# EAGLE design Modular Recon Drone (EAGLE 9.0.1)
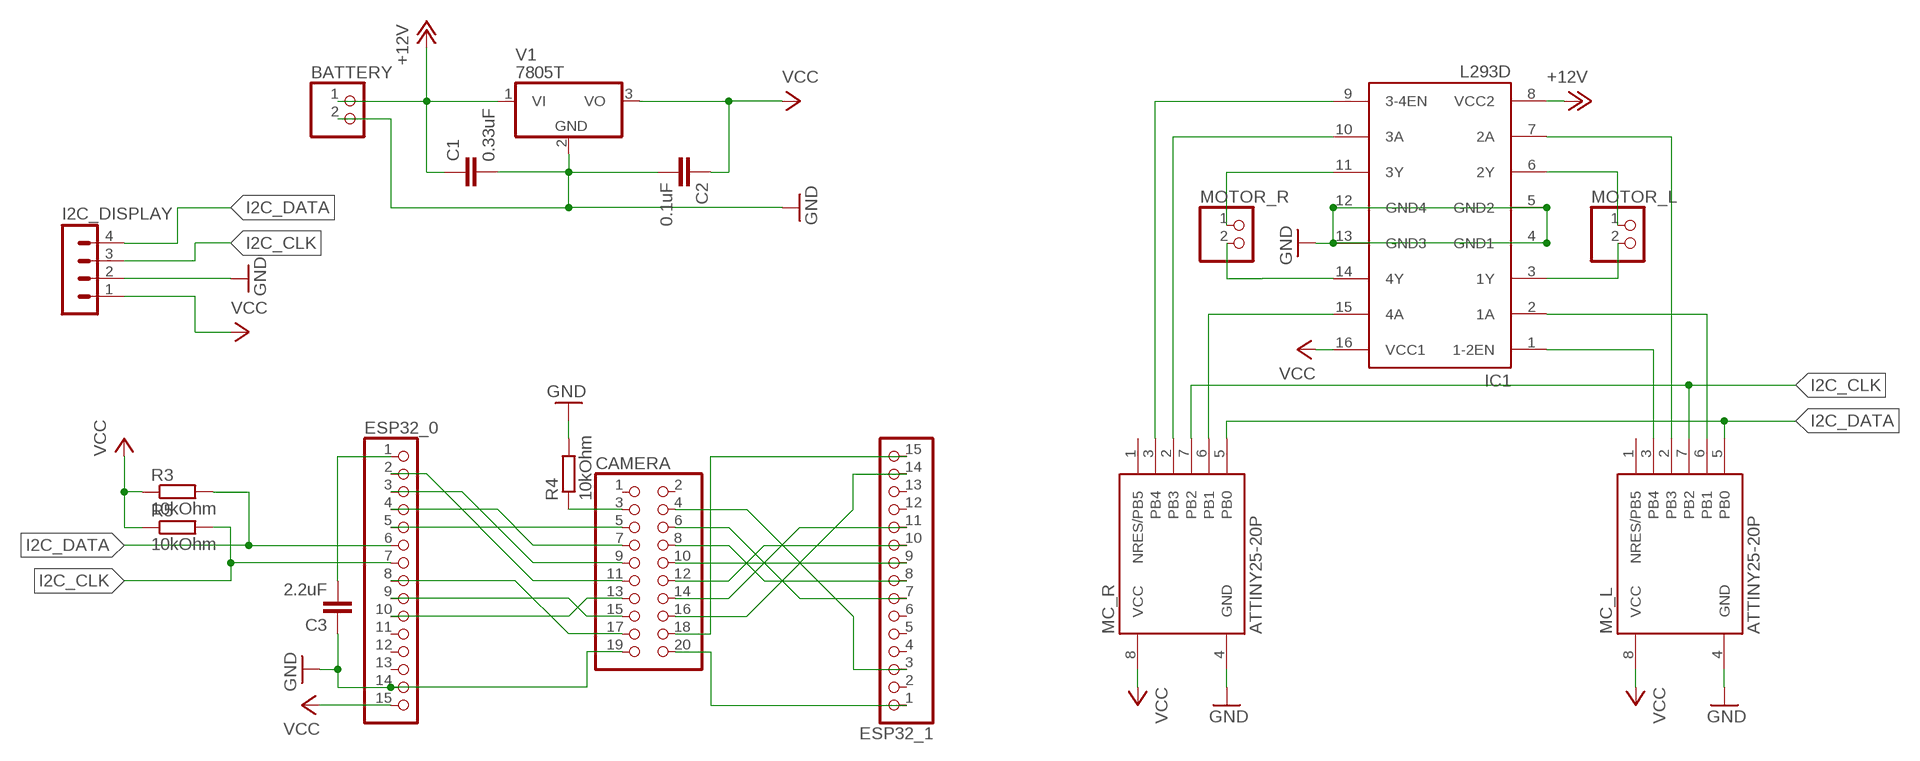
[diagram p0: schematic, sheet 1]

## Parts
BATTERY  PINHD-1X2  [1X02]
C1  0.33uF  C-EU025-050X050  [C025-050X050]
C2  0.1uF  C-EU025-050X050  [C025-050X050]
C3  2.2uF  C-EU025-050X050  [C025-050X050]
CAMERA  PINHD-2X10  [2X10]
ESP32_0  PINHD-1X15  [1X15]
ESP32_1  PINHD-1X15  [1X15]
I2C_DISPLAY  MA04-1  [MA04-1]
IC1  L293D  [DIL16]
MC_L  ATTINY25-20P  [PDIP08_300MIL]
MC_R  ATTINY25-20P  [PDIP08_300MIL]
MOTOR_L  PINHD-1X2  [1X02]
MOTOR_R  PINHD-1X2  [1X02]
R3  10kOhm  R-EU_0204/5  [0204/5]
R4  10kOhm  R-EU_0204/5  [0204/5]
R5  10kOhm  R-EU_0204/5  [0204/5]
V1  7805T  [TO220H]

## Nets
+12V [power]: BATTERY.1 C1.1 IC1.8(VCC2) V1.1(VI)
GND: BATTERY.2 C1.2 C2.2 C3.1 CAMERA.19 ESP32_0.14 I2C_DISPLAY.2 IC1.4(GND1) IC1.5(GND2) IC1.12(GND4) IC1.13(GND3) MC_L.4(GND) MC_R.4(GND) R4.2 V1.2(GND)
I2C_CLK: ESP32_0.7 I2C_DISPLAY.3 MC_L.7(PB2) MC_R.7(PB2) R5.2
I2C_DATA: ESP32_0.6 I2C_DISPLAY.4 MC_L.5(PB0) MC_R.5(PB0) R3.2
N$1: IC1.3(1Y) MOTOR_L.2
N$2: IC1.6(2Y) MOTOR_L.1
N$4: IC1.14(4Y) MOTOR_R.2
N$5: IC1.15(4A) MC_R.6(PB1)
N$6: IC1.11(3Y) MOTOR_R.1
N$7: IC1.2(1A) MC_L.6(PB1)
N$8: IC1.10(3A) MC_R.2(PB3)
N$9: IC1.7(2A) MC_L.2(PB3)
N$10: IC1.9(3-4EN) MC_R.3(PB4)
N$11: IC1.1(1-2EN) MC_L.3(PB4)
N$12: CAMERA.20 ESP32_1.1
N$13: CAMERA.18 ESP32_1.15
N$14: CAMERA.16 ESP32_1.14
N$15: CAMERA.14 ESP32_1.11
N$16: CAMERA.12 ESP32_1.10
N$17: CAMERA.10 ESP32_1.9
N$18: CAMERA.8 ESP32_1.8
N$19: CAMERA.6 ESP32_1.7
N$20: CAMERA.4 ESP32_1.3
N$21: CAMERA.17 ESP32_0.8
N$22: CAMERA.15 ESP32_0.9
N$23: CAMERA.13 ESP32_0.10
N$24: CAMERA.11 ESP32_0.2
N$25: CAMERA.9 ESP32_0.3
N$26: CAMERA.7 ESP32_0.4
N$27: CAMERA.5 ESP32_0.5
N$28: CAMERA.3 R4.1
N$29: C3.2 ESP32_0.1
VCC: C2.1 ESP32_0.15 I2C_DISPLAY.1 IC1.16(VCC1) MC_L.8(VCC) MC_R.8(VCC) R3.1 R5.1 V1.3(VO)
Unconnected: CAMERA.1 CAMERA.2 ESP32_0.11 ESP32_0.12 ESP32_0.13 ESP32_1.2 ESP32_1.4 ESP32_1.5 ESP32_1.6 ESP32_1.12 ESP32_1.13 MC_L.1(NRES/PB5) MC_R.1(NRES/PB5)

## Library data of the parts
BATTERY MOTOR_L MOTOR_R = pinhead:PINHD-1X2: PIN HEADER
C1-C3 = rcl:C-EU: CAPACITOR, European symbol; SPICEPREFIX: C
CAMERA = pinhead:PINHD-2X10: PIN HEADER
ESP32_0 ESP32_1 = pinhead:PINHD-1X15: PIN HEADER
I2C_DISPLAY = con-lstb:MA04-1: PIN HEADER; OC_FARNELL: unknown; OC_NEWARK: unknown
IC1 = st-microelectronics:L293D: PUSH-PULL 4 CHANNEL DRIVER; MPN: L293D; OC_FARNELL: 9589619; OC_NEWARK: 56P8249
MC_L MC_R = _hhn_attiny25_45_85:ATTINY25*: ATMEL ATtiny 25 Packages: P = PDIP 08 30mil S = SOIC 08 EIAJ 208mil SS = SOIC 08 JEDEC 150mil Technologies Note: for complete ordering code (temp. range, finish, tape&reel etc.) see www.atmel.com • Supply Voltage: V = (1.8…5.5)V | [blank] = (2.7…5.5)V • Speed: 10 = 10 MHz | 20 = 20 MHz Author: Dipl.-Ing. FH Rainer Bayer HHN Hochschule Heilbronn (Heilbronn University), rainer.bayer@hs-heilbronn.de Ingenieurbüro ing-rb, mail@ing-rb.de
R3-R5 = rcl:R-EU_: RESISTOR, European symbol; SPICEPREFIX: R
V1 = linear:78*: Positive VOLTAGE REGULATOR Source: http://cache.national.com/ds/LM/LM78L05.pdf http://www.fairchildsemi.com/ds/LM/LM7805.pdf

## Net classes
1 power: width 1.27 mm, clearance 0.254 mm

## Board
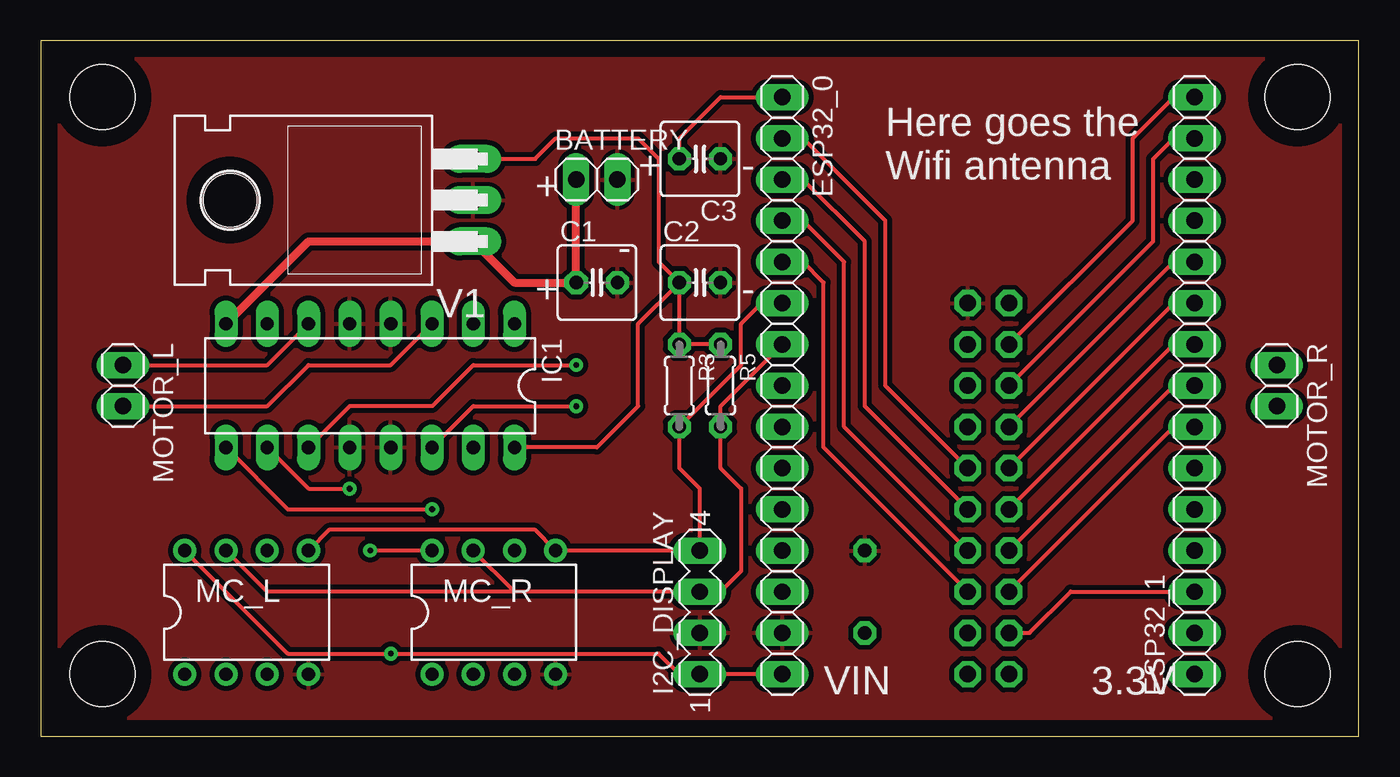
[diagram p1: board, top side]
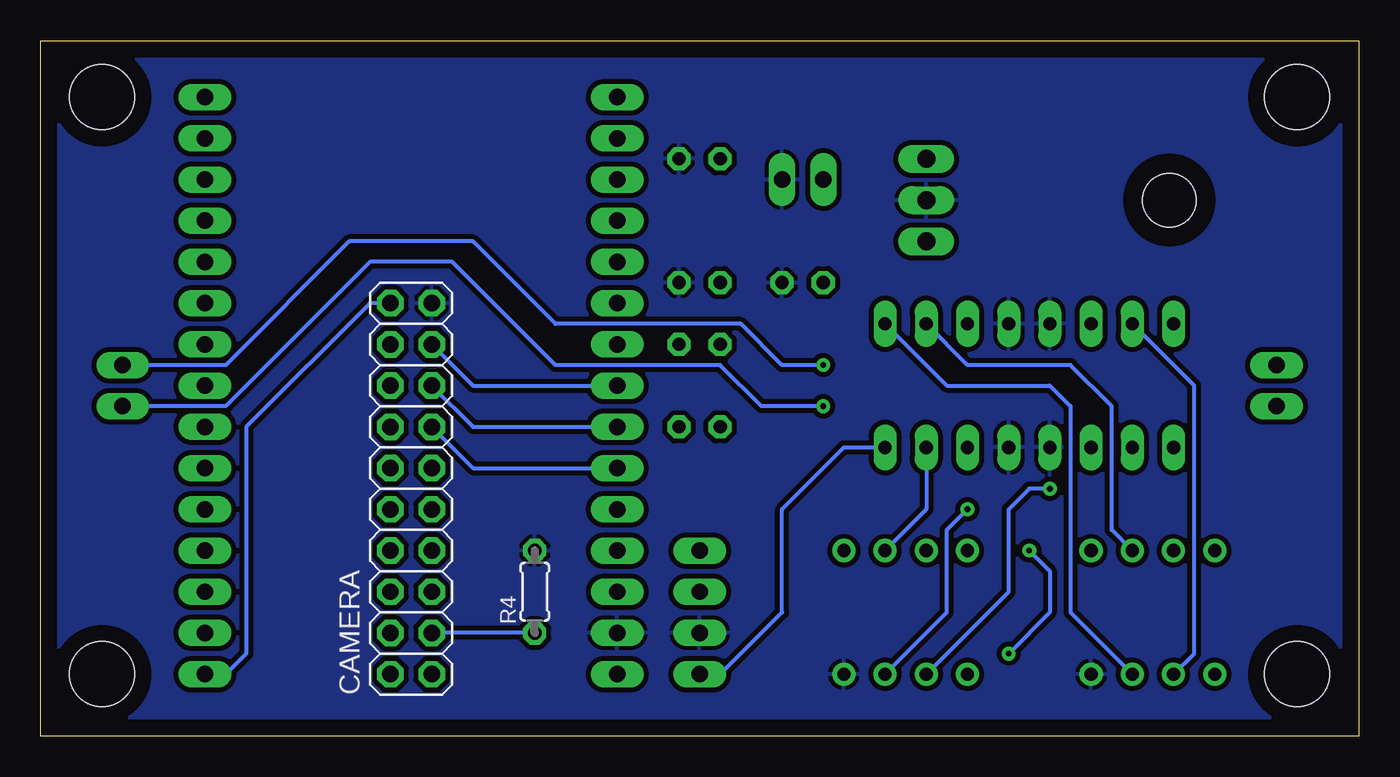
[diagram p2: board, bottom side, seen from below]

Size 81.26 x 42.85 mm. Coordinates in mm from the lower left corner, seen from the top.
Outline: 0,0 81.26,0 81.26,42.85 0,42.85 0,0
Copper layers (1*16): Top 0.035mm / dielectric 1.5mm / Bottom 0.035mm
Design rules "default *": minimum track width 10mil, minimum drill 0.35mm, track to track 8mil, track to pad 8mil, pad to pad 8mil, via to via 8mil, smd to smd 8mil, copper to edge 40mil, drill to drill 6mil, minimum pad ring 12mil, minimum via ring 10mil, stop-mask expansion 4mil, vias tented up to drill 0mil, thermal gap 10mil
Holes 4 mm at 3.81,39.37 3.81,3.81 77.47,3.81 77.47,39.37

### Footprints (pad centres in the part's own frame; a part is rotated, then mirrored left to right if it is on the bottom)
1X02 = drill 1.016 long: 1 -1.27,0; 2 1.27,0
C025-050X050 = drill 0.813 octagon: 1 -1.27,0; 2 1.27,0
2X10 = drill 1.016 octagon: 1 -11.43,-1.27; 2 -11.43,1.27; 3 -8.89,-1.27; 4 -8.89,1.27; 5 -6.35,-1.27; 6 -6.35,1.27; 7 -3.81,-1.27; 8 -3.81,1.27; 9 -1.27,-1.27; 10 -1.27,1.27; 11 1.27,-1.27; 12 1.27,1.27; 13 3.81,-1.27; 14 3.81,1.27; 15 6.35,-1.27; 16 6.35,1.27; 17 8.89,-1.27; 18 8.89,1.27; 19 11.43,-1.27; 20 11.43,1.27
1X15 = drill 1.016 long: 1 -17.78,0; 2 -15.24,0; 3 -12.7,0; 4 -10.16,0; 5 -7.62,0; 6 -5.08,0; 7 -2.54,0; 8 0,0; 9 2.54,0; 10 5.08,0; 11 7.62,0; 12 10.16,0; 13 12.7,0; 14 15.24,0; 15 17.78,0
MA04-1 = drill 1.016 long: 1 -3.81,0; 2 -1.27,0; 3 1.27,0; 4 3.81,0
DIL16 = drill 0.813 long: 1 -8.89,-3.81; 2 -6.35,-3.81; 3 -3.81,-3.81; 4 -1.27,-3.81; 5 1.27,-3.81; 6 3.81,-3.81; 7 6.35,-3.81; 8 8.89,-3.81; 9 8.89,3.81; 10 6.35,3.81; 11 3.81,3.81; 12 1.27,3.81; 13 -1.27,3.81; 14 -3.81,3.81; 15 -6.35,3.81; 16 -8.89,3.81
PDIP08_300MIL = drill 0.813: 1 -3.81,-3.81; 2 -1.27,-3.81; 3 1.27,-3.81; 4 3.81,-3.81; 5 3.81,3.81; 6 1.27,3.81; 7 -1.27,3.81; 8 -3.81,3.81
0204/5 = drill 0.813 octagon: 1 -2.54,0; 2 2.54,0
TO220H = drill 1.118 long: 1 -2.54,-10.16; 2 0,-10.16; 3 2.54,-10.16 | hole 3.302: 0,4.826

### Placement (x,y rotation side)
BATTERY  34.29,34.29 0 top
C1  34.29,27.94 0 top
C2  40.64,27.94 0 top
C3  40.64,35.56 180 top
CAMERA  58.42,15.24 90 bottom
ESP32_0  45.72,21.59 270 top
ESP32_1  71.12,21.59 90 top
I2C_DISPLAY  40.64,7.62 90 top
IC1  20.32,21.59 180 top
MC_L  12.7,7.62 0 top
MC_R  27.94,7.62 0 top
MOTOR_L  5.08,21.59 270 top
MOTOR_R  76.2,21.59 270 top
R3  39.37,21.59 270 top
R4  50.8,8.89 90 bottom
R5  41.91,21.59 270 top
V1  16.51,33.02 90 top

### Tracks (layer width: path | path; a pad name or v marks a point on that pad's centre or on a via)
+12V
  Top 0.508: IC1.8 16.51,30.48 V1.1 29.21,27.94 C1.1 BATTERY.1
GND
  pour Bottom (isolate 0.305): -1.27,44.45 -1.27,-2.54 87.63,-2.54 86.36,44.45
  pour Top (isolate 0.305): -1.27,44.45 -1.27,-1.27 87.63,-1.27 87.63,44.45
I2C_CLK
  Top 0.254: 29.21,8.89 I2C_DISPLAY.3 41.91,8.89 43.18,10.16 43.18,15.24 41.91,16.51 R5.2 41.91,20.32 ESP32_0.7 | 29.21,8.89 MC_R.7 | 29.21,8.89 13.97,8.89 MC_L.7
I2C_DATA
  Top 0.254: MC_L.5 17.78,12.7 30.48,12.7 MC_R.5 I2C_DISPLAY.4 40.64,15.24 39.37,16.51 R3.2 43.18,22.86 43.18,25.4 44.45,26.67 ESP32_0.6
N$1
  Top 0.254: MOTOR_L.2 13.97,20.32 16.51,22.86 21.59,22.86 IC1.3
N$2
  Top 0.254: MOTOR_L.1 13.97,22.86 IC1.6
N$4  (via drill 0.35)
  Top 0.254: IC1.14 26.67,20.32 v33.02,20.32
  Bottom 0.254: v33.02,20.32 36.83,20.32 39.37,22.86 49.53,22.86 55.88,29.21 60.96,29.21 69.85,20.32 MOTOR_R.2
N$5
  Bottom 0.254: MC_R.6 26.67,13.97 IC1.15
N$6  (via drill 0.35)
  Top 0.254: IC1.11 19.05,20.32 24.13,20.32 26.67,22.86 v33.02,22.86
  Bottom 0.254: v33.02,22.86 35.56,22.86 38.1,25.4 49.53,25.4 54.61,30.48 62.23,30.48 69.85,22.86 MOTOR_R.1
N$7
  Bottom 0.254: MC_L.6 15.24,12.7 15.24,20.32 17.78,22.86 24.13,22.86 IC1.2
N$8  (via drill 0.35)
  Top 0.254: IC1.10 16.51,15.24 v19.05,15.24
  Bottom 0.254: v19.05,15.24 20.32,15.24 21.59,13.97 21.59,8.89 MC_R.2
N$9
  Bottom 0.254: MC_L.2 10.16,5.08 10.16,21.59 IC1.7
N$10  (via drill 0.35)
  Top 0.254: v24.13,13.97 15.24,13.97 IC1.9
  Bottom 0.254: MC_R.3 27.94,5.08 25.4,7.62 25.4,12.7 v24.13,13.97
N$11
  Bottom 0.254: IC1.1 25.4,21.59 19.05,21.59 17.78,20.32 17.78,7.62 MC_L.3
N$12
  Bottom 0.254: CAMERA.20 60.96,26.67 68.58,19.05 68.58,5.08 69.85,3.81 ESP32_1.1
N$13
  Top 0.254: CAMERA.18 67.31,31.75 67.31,36.83 69.85,39.37 ESP32_1.15
N$14
  Top 0.254: CAMERA.16 68.58,30.48 68.58,35.56 69.85,36.83 ESP32_1.14
N$15
  Top 0.254: CAMERA.14 69.85,29.21 ESP32_1.11
N$16
  Top 0.254: CAMERA.12 69.85,26.67 ESP32_1.10
N$17
  Top 0.254: CAMERA.10 69.85,24.13 ESP32_1.9
N$18
  Top 0.254: CAMERA.8 69.85,21.59 ESP32_1.8
N$19
  Top 0.254: CAMERA.6 69.85,19.05 ESP32_1.7
N$20
  Top 0.254: CAMERA.4 60.96,6.35 63.5,8.89 ESP32_1.3
N$21
  Bottom 0.254: CAMERA.17 54.61,21.59 ESP32_0.8
N$22
  Bottom 0.254: CAMERA.15 54.61,19.05 ESP32_0.9
N$23
  Bottom 0.254: CAMERA.13 54.61,16.51 ESP32_0.10
N$24
  Top 0.254: CAMERA.11 52.07,21.59 52.07,31.75 46.99,36.83 ESP32_0.2
N$25
  Top 0.254: CAMERA.9 50.8,20.32 50.8,30.48 46.99,34.29 ESP32_0.3
N$26
  Top 0.254: CAMERA.7 49.53,19.05 49.53,29.21 46.99,31.75 ESP32_0.4
N$27
  Top 0.254: CAMERA.5 48.26,17.78 48.26,27.94 46.99,29.21 ESP32_0.5
N$28
  Bottom 0.254: R4.1 CAMERA.3
N$29
  Top 0.254: C3.2 39.37,36.83 41.91,39.37 ESP32_0.1
VCC  (via drill 0.35)
  Top 0.254: ESP32_0.15 I2C_DISPLAY.1 39.37,3.81 38.1,5.08 v21.59,5.08 15.24,5.08 MC_L.8 | IC1.16 34.29,17.78 36.83,20.32 36.83,25.4 C2.1 | C2.1 38.1,29.21 38.1,35.56 36.83,36.83 31.75,36.83 30.48,35.56 V1.3 | MC_R.8 v20.32,11.43 | R5.1 R3.1 C2.1
  Bottom 0.254: v20.32,11.43 19.05,10.16 19.05,7.62 v21.59,5.08 | I2C_DISPLAY.1 39.37,3.81 35.56,7.62 35.56,13.97 31.75,17.78 IC1.16

### Text on the board
tNames: + | - | Here goes the / Wifi antenna | + | - | + | - | VIN | 3.3V
tValues: - | +